# Altium schematic sheet Bipolar_PSU_Sheet.SchDoc
size A4
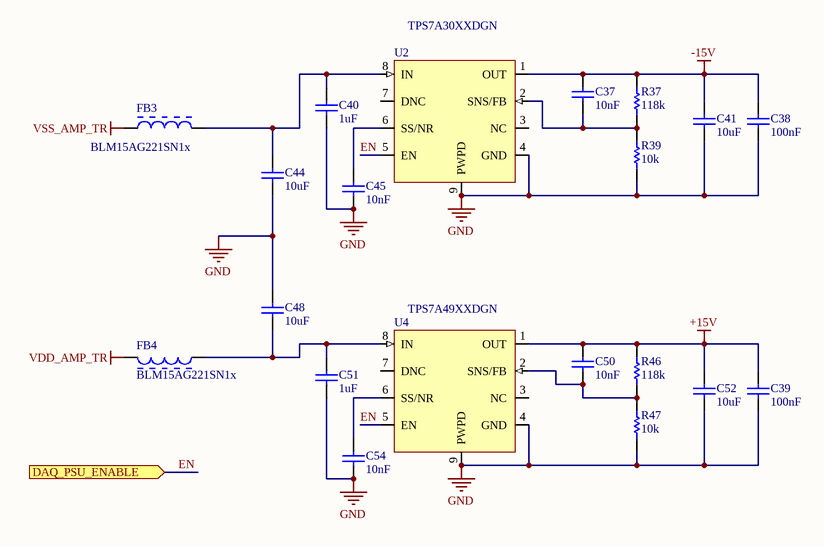
[diagram p0: Bipolar_PSU_Sheet.SchDoc]

## Parts
C37  value 10nF  [CAPC0402(1005)60_L]  (hidden comment: CAP0402)
C38  value 100nF  [CAPC0402(1005)60_L]  (hidden comment: CAP0402)
C39  value 100nF  [CAPC0402(1005)60_L]  (hidden comment: CAP0402)
C40  1uF  [0603]
C41  10uF  [C1206]
C44  10uF  [C1206]
C45  value 10nF  [CAPC0402(1005)60_L]  (hidden comment: CAP0402)
C48  10uF  [C1206]
C50  value 10nF  [CAPC0402(1005)60_L]  (hidden comment: CAP0402)
C51  1uF  [0603]
C52  10uF  [C1206]
C54  value 10nF  [CAPC0402(1005)60_L]  (hidden comment: CAP0402)
FB3  BLM15AG221SN1x  [MURA-BLM15AG221SN1x_V]
FB4  BLM15AG221SN1x  [MURA-BLM15AG221SN1x_V]
R37  value 118k  [RESC0402(1005)_L]  (hidden comment: RES0402)
R39  value 10k  [RESC0402(1005)_L]  (hidden comment: RES0402)
R46  value 118k  [RESC0402(1005)_L]  (hidden comment: RES0402)
R47  value 10k  [RESC0402(1005)_L]  (hidden comment: RES0402)
U2  TPS7A30XXDGN  [DGN-8]
U4  TPS7A49XXDGN  [DGN-8]

## Ports
DAQ_PSU_ENABLE (in)

## Nets
+15V: C39.2 C50.2 C52.2 R46.2 U4.1(OUT)
-15V: C37.2 C38.2 C41.2 R37.2 U2.1(OUT)
GND: C38.1 C39.1 C40.1 C41.1 C44.1 C45.1 C48.2 C51.1 C52.1 C54.1 R39.1 R47.1 U2.4(GND) U2.9(PWPD) U4.4(GND) U4.9(PWPD)
VDD_AMP_TR: FB4.2
VSS_AMP_TR: FB3.1
EN: U2.5(EN) U4.5(EN) ; port DAQ_PSU_ENABLE
NetC37_1: C37.1 R37.1 R39.2 U2.2(SNS/FB)
NetC40_2: C40.2 C44.2 FB3.2 U2.8(IN)
NetC45_2: C45.2 U2.6(SS/NR)
NetC48_1: C48.1 C51.2 FB4.1 U4.8(IN)
NetC50_1: C50.1 R46.1 R47.2 U4.2(SNS/FB)
NetC54_2: C54.2 U4.6(SS/NR)

Not connected (* = marked no-connect by the designer): U2 3(NC) 7(DNC); U4 3(NC) 7(DNC)

## Library data of the parts
C37-C39 C45 C50 C54 = CMP-1590-00004-1: 0402 (1005 Metric) Chip Capacitor; Case-EIA: 0402; Case-Metric: 1005; PackageReference: CAPC0402(1005)60
C40 C51 = C_0603_1uF_25V_CER: Capacitor; Manufacturer Part Number: 0603X105K250CT; Voltage Rating: 25V; Unit Cost: .02; Supplier 1: Farnell; Supplier Part Number 1: 2496918; ComponentLinkURL1: http://ie.farnell.com/walsin/0603x105k6r3ct/capacitor-mlcc-x5r-1uf-6-3v-0603/dp/2496919; Value: 1uF
C41 C44 C48 C52 = C_1206_10uF_25V_CER: Capacitor; Manufacturer Part Number: 1206X106K250CT; Voltage Rating: 25V; Unit Cost: .07; Supplier 1: Farnell; Supplier Part Number 1: 2497152RL; ComponentLinkURL1: http://ie.farnell.com/walsin/1206x106k250ct/capacitor-mlcc-x5r-10uf-25v-1206/dp/2497152RL; Value: 10uF
FB3 FB4 = CMP-1662-00018-3: Chip Bead, 220 Ohm, +/- 25 %, 100 MHz, 300 mA, -55 to 125 degC, 0402 (1005 Metric), RoHS; Tolerance: 25%; Current Rating: 200 mA; Max Current Rating: 450 mA; Resistance: 220 Ohm; Package Quantity: 10000; DatasheetVersion: 03/2011; Radiation Hardening: No; Case Code (Imperial): 0402; Length: 1 mm; RoHSCompliant: True; ComponentLink1URL: http://www.murata.com/; Case/Package: 0402; Width: 0.5 mm; Mounting Technology: Surface Mount; REACH SVHC: No SVHC; Height: 0.5 mm; ComponentLink2Description: Datasheet; PartNumber: BLM15AG221SN1x; ComponentLink1Description: Manufacturer URL; Max Operating Temperature: 125 degC; PackageDescription: 2-Pin Surface Mount Device, Body 1 x 0.5 mm; Case Code (Metric): 1005; ComponentLink2URL: https://datasheet.ciiva.com/11800/0900766b811b5866-11800858.pdf; Min Operating Temperature: -55 degC
R37 R39 R46 R47 = CMP-1591-00004-1: 0402 (1005 Metric) Chip Resistor; Case-EIA: 0402; Case-Metric: 1005; PackageReference: RESC0402(1005)
U2 = TPS7A30XXDGN: IC, -3V to -36V, -200mA, Ultralow Noise, High-PSRR LDO Negative Linear Regulator; Alternate Manufacturer: None; Manufacturer: TI; PartNumber: TPS7A3001DGNT; Area: 35250; Unit Cost: 3.95; Alternate PartNumber: *; Altium Migration: *; ComponentHeight: 0.047; ComponentLink1Description: AEO Datasheet Link; ComponentLink1URL: http://ie.farnell.com/texas-instruments/tps7a3001dgnt/ic-ldo-neg-adj-200ma-8msop/dp/1855138; PackageReference: MSOP-8; SymbolVersion: 10/28/2009 14:24; Value: *; Supplier 1: Farnell; Supplier Part Number 1: 1855138
U4 = TPS7A49XXDGN: IC, 3V to 36V, 150mA, Ultralow Noise, High-PSRR LDO Positive Linear Regulator; Alternate Manufacturer: None; Manufacturer: TI; PartNumber: TPS7A4901DGNT; Area: 35250; Value: TPS7A4901DGNT; Unit Cost: 2.64; Alternate PartNumber: *; Altium Migration: *; ComponentHeight: 0.047; ComponentLink1Description: AEO Datasheet Link; ComponentLink1URL: http://ie.farnell.com/texas-instruments/tps7a4901dgnt/ic-ldo-adj-150ma-8msop/dp/1841881; PackageReference: MSOP-8; SymbolVersion: 10/28/2009 14:24; Supplier 1: Farnell; Supplier Part Number 1: 1841881